# EAGLE design ZORRO-LAN-IDE-CP-V2EFront (EAGLE 6.5.0)
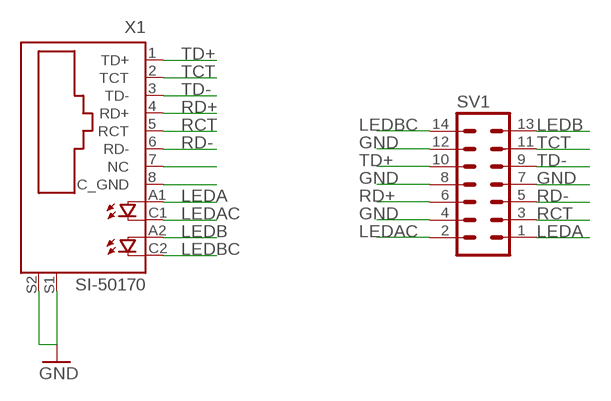
[diagram p0: schematic, sheet 1]

## Parts
SV1  ML14  [ML14]
X1  SI-50170  [SI-50170]

## Nets
GND: SV1.4 SV1.7 SV1.8 SV1.12 X1.7(NC) X1.8(C_GND) X1.S1 X1.S2
LEDA: SV1.1 X1.A1(A)
LEDAC: SV1.2 X1.C1(C)
LEDB: SV1.13 X1.A2(A1)
LEDBC: SV1.14 X1.C2(C1)
RCT: SV1.3 X1.5(RCT)
RD+: SV1.6 X1.4(RD+)
RD-: SV1.5 X1.6(RD-)
TCT: SV1.11 X1.2(TCT)
TD+: SV1.10 X1.1(TD+)
TD-: SV1.9 X1.3(TD-)

## Library data of the parts
SV1 = con-ml:ML14: HARTING; OC_FARNELL: unknown; OC_NEWARK: unknown
X1 = con-stewart:SI-50170: Ethernet Connector MagJack (R) Source: www.stewartconnector.com .. si-50170.pdf; OC_FARNELL: unknown; OC_NEWARK: unknown

## Board
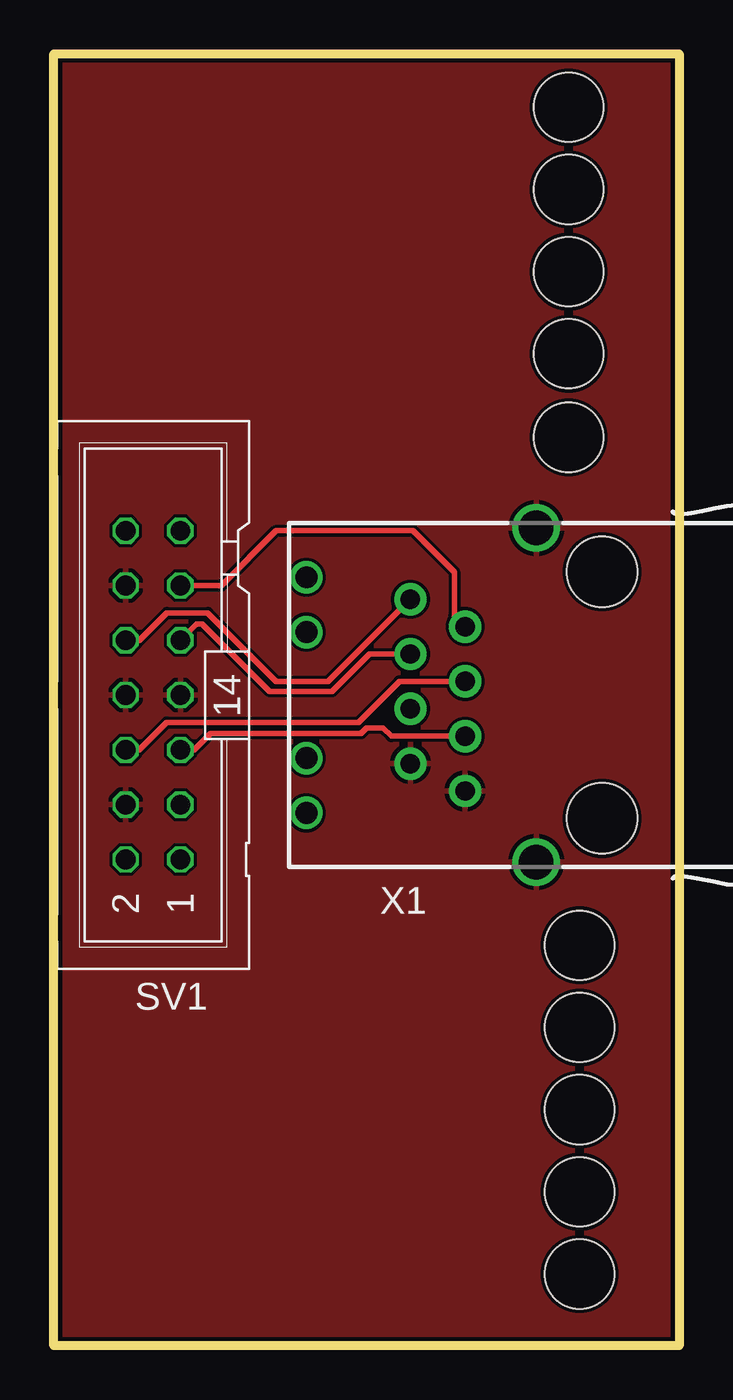
[diagram p1: board, top side]
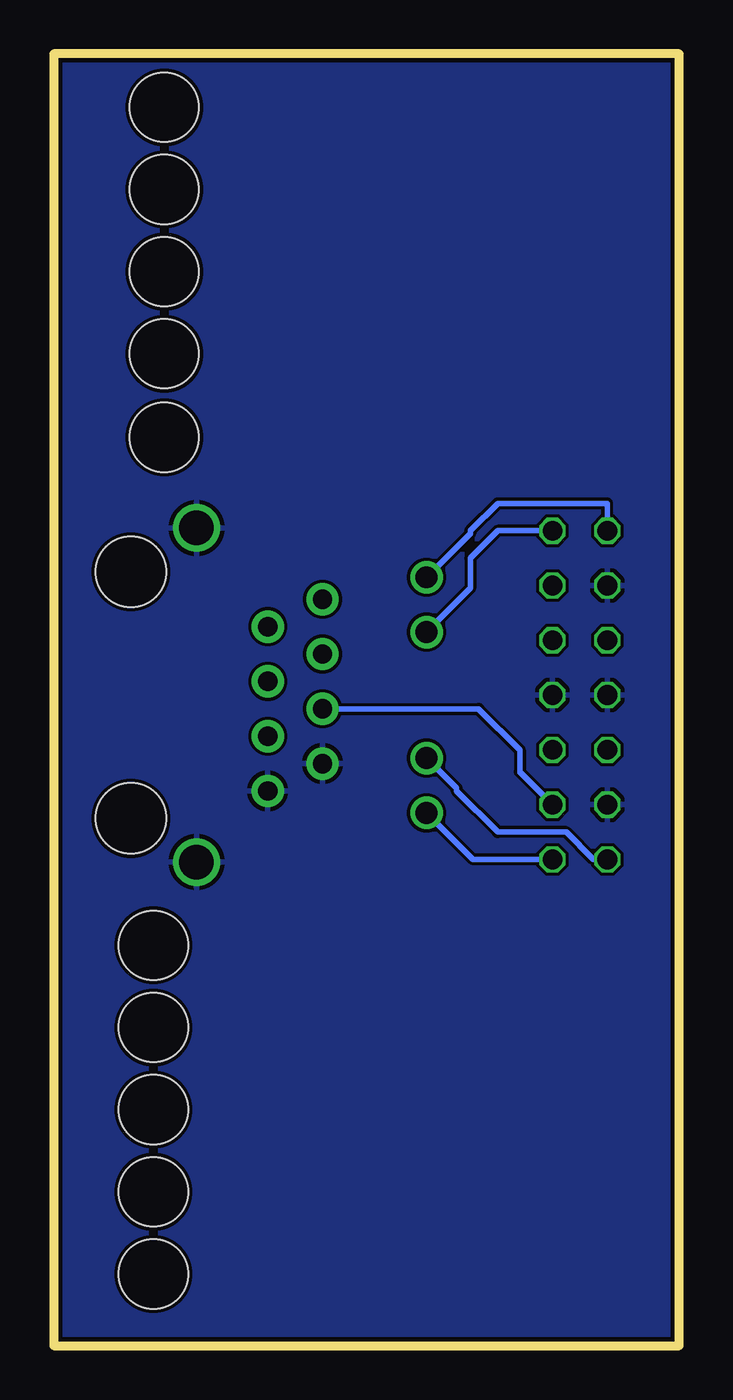
[diagram p2: board, bottom side, seen from below]

Size 29 x 59.9 mm. Coordinates in mm from the lower left corner, seen from the top.
Outline: 29,0 0,0 0,59.9 29,59.9 29,0
Copper layers (1*16): Top 0.035mm / dielectric 1.5mm / Bottom 0.035mm
Design rules "Eagle-DRU - 1506 - LeitOn - 01 and 02 layers - STANDARD": minimum track width 0.15mm, minimum drill 0.3mm, track to track 0.15mm, track to pad 0.15mm, pad to pad 0.15mm, via to via 0.15mm, smd to smd 0.15mm, copper to edge 0.2mm, drill to drill 0.25mm, minimum pad ring 0.15mm, minimum via ring 0.15mm, stop-mask expansion 0.05mm, vias tented up to drill 0mil, thermal gap 0.2mm
Holes 3.2 mm at 24.39,18.56 23.88,42.12 24.39,14.75 24.39,10.94 24.39,7.13 24.39,3.32 23.88,45.99 23.88,49.8 23.88,53.61 23.88,57.42

### Footprints (pad centres in the part's own frame; a part is rotated, then mirrored left to right if it is on the bottom)
ML14 = drill 0.914 octagon: 1 -7.62,-1.27; 2 -7.62,1.27; 3 -5.08,-1.27; 4 -5.08,1.27; 5 -2.54,-1.27; 6 -2.54,1.27; 7 0,-1.27; 8 0,1.27; 9 2.54,-1.27; 10 2.54,1.27; 11 5.08,-1.27; 12 5.08,1.27; 13 7.62,-1.27; 14 7.62,1.27
SI-50170 = drill 0.9 pad 1.5: 1 4.445,5.842; 2 3.175,3.302; 3 1.905,5.842; 4 0.635,3.302; 5 -0.635,5.842; 6 -1.905,3.302; 7 -3.175,5.842; 8 -4.445,3.302 | drill 1.016 pad 1.5: A1 -5.461,10.668; A2 2.921,10.668; C1 -2.921,10.668; C2 5.461,10.668 | drill 1.6 pad 2.2: S1 -7.747,0; S2 7.747,0 | hole 3.251: -5.715,-3.048; 5.715,-3.048

### Placement (x,y rotation side)
SV1  4.6,30.17 90 top
X1  22.38,30.17 90 top

### Tracks (layer width: path | path; a pad name or v marks a point on that pad's centre or on a via)
GND
  pour Bottom: -0.75,60.42 29.48,60.42 29.48,-0.25 -0.75,-0.5
  pour Top: -0.39,60.3 29.37,60.3 29.12,-0.14 -0.39,-0.14
LEDA
  Bottom 0.254: SV1.1 9.55,22.55 X1.A1
LEDAC
  Bottom 0.254: SV1.2 3.97,22.55 5.23,23.82 8.41,23.82 10.31,25.72 10.31,25.85 X1.C1
LEDB
  Bottom 0.254: SV1.13 8.41,37.79 9.68,36.52 9.68,35.12 X1.A2
LEDBC
  Bottom 0.254: SV1.14 3.33,39.06 8.41,39.06 9.68,37.79 9.68,37.66 X1.C2
RCT
  Bottom 0.254: X1.5 9.3,29.53 7.39,27.63 7.39,26.61 SV1.3
RD+
  Top 0.254: SV1.6 3.97,27.63 5.23,28.9 14.12,28.9 16.03,30.8 X1.4
RD-
  Top 0.254: SV1.5 6.5,27.63 7.27,28.39 14.25,28.39 14.51,28.64 15.27,28.64 15.65,28.26 X1.6
TCT
  Top 0.254: SV1.11 7.78,35.25 10.31,37.79 16.67,37.79 18.57,35.88 18.57,33.85 X1.2
TD+
  Top 0.254: SV1.10 3.97,32.71 5.23,33.98 7.14,33.98 10.31,30.8 12.73,30.8 X1.1
TD-
  Top 0.254: X1.3 14.63,32.07 12.91,30.34 10.01,30.34 6.89,33.47 6.63,33.47 SV1.9